# EAGLE design 3DRacers_Pilot (EAGLE 6.4)
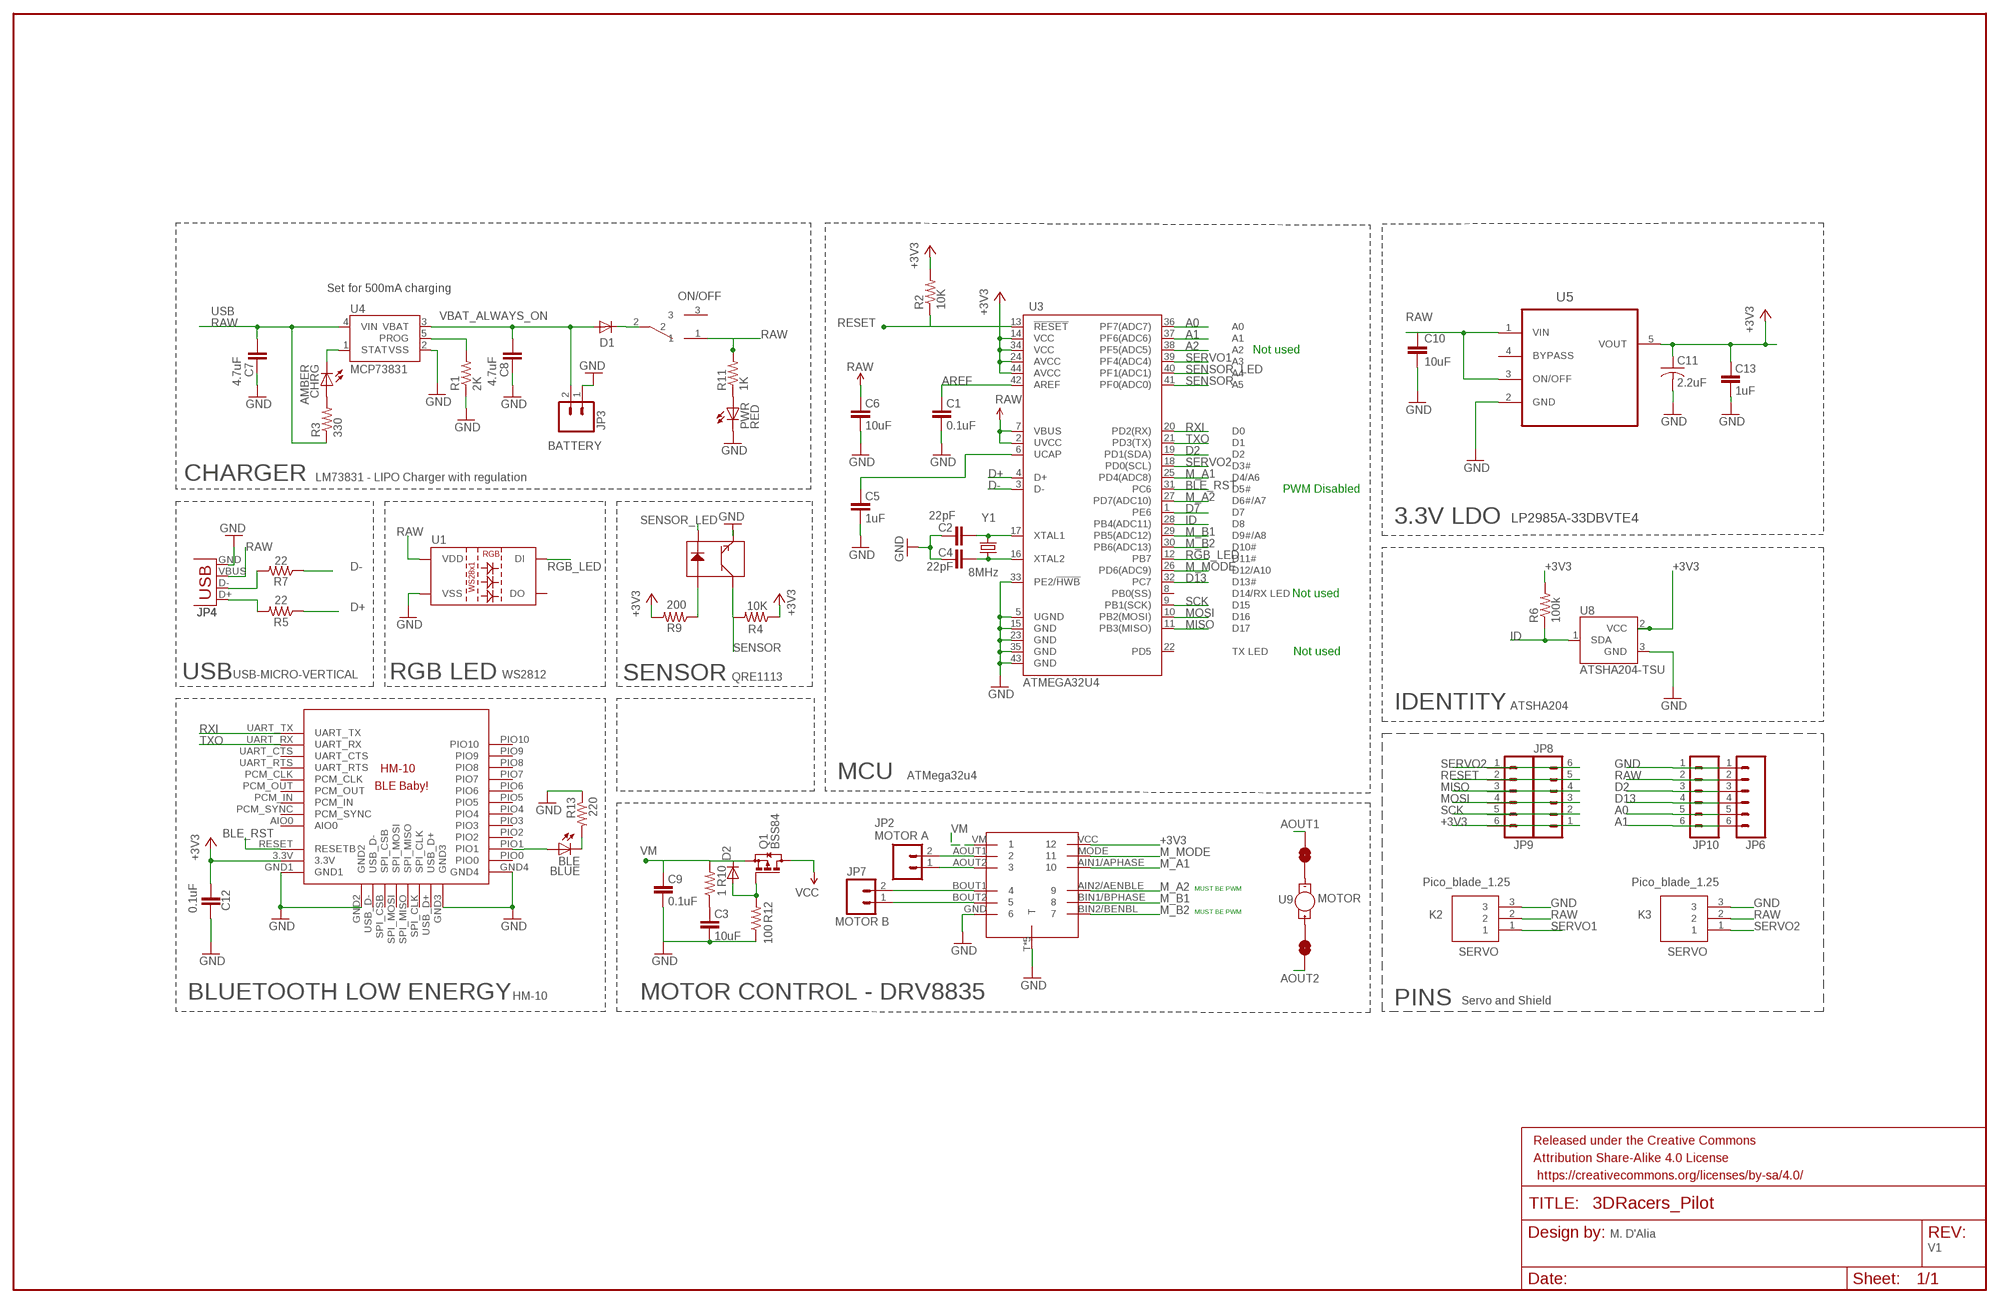
[diagram p0: schematic, sheet 1]

## Parts
BLE  BLUE  LED0603  [LED-0603]
C1  0.1uF  CAP0603-CAP  [0603-CAP]
C2  22pF  CAP0603-CAP  [0603-CAP]
C3  10uF  CAP0805  [0805]
C4  22pF  CAP0603-CAP  [0603-CAP]
C5  1uF  CAP0603-CAP  [0603-CAP]
C6  10uF  CAP0603-CAP  [0603-CAP]
C7  4.7uF  CAP0603-CAP  [0603-CAP]
C8  4.7uF  CAP0603-CAP  [0603-CAP]
C9  0.1uF  CAP0603-CAP  [0603-CAP]
C10  10uF  CAP0805  [0805]
C11  2.2uF  C-USC0603K  [C0603K]
C12  0.1uF  CAP0603-CAP  [0603-CAP]
C13  1uF  CAP0805  [0805]
CHRG  AMBER  LED0603  [LED-0603]
D1  DIODESOD  [SOD-323]
D2  DIODESOD  [SOD-323]
FRAME2  FRAME-LEDGER  [CREATIVE_COMMONS]
JP2  M021X02_NO_SILK  [1X02_NO_SILK]
JP3  M02JST-PTH-VERT  [JST-2-PTH-VERT]
JP4  USB-MICRO-VERTICAL  [USB-MICRO-VERTICAL]
JP6  M06SMD-STRAIGHT  [1X06_SMD_STRAIGHT]
JP7  M021X02_NO_SILK  [1X02_NO_SILK]
JP8  M06SMD-STRAIGHT-ALT-NOSILK  [1X06_SMD_STRAIGHT_ALT_NOSILK]
JP9  M06LOCK_LONGPADS  [1X06_LOCK_LONGPADS]
JP10  M06LOCK_LONGPADS  [1X06_LOCK_LONGPADS]
K2  PICO_BLADE_1.25  [PICO_BLADE_1.25]
K3  PICO_BLADE_1.25  [PICO_BLADE_1.25]
PWR  RED  LED0603  [LED-0603]
Q1  BSS84  [SOT23]
R1  2K  RESISTOR0603-RES  [0603-RES]
R2  10K  RESISTOR0603-RES  [0603-RES]
R3  330  RESISTOR0603-RES  [0603-RES]
R4  10K  RESISTOR0603-RES  [0603-RES]
R5  22  RESISTOR0603-RES  [0603-RES]
R6  100k  RESISTOR0603-RES  [0603-RES]
R7  22  RESISTOR0603-RES  [0603-RES]
R9  200  RESISTOR0603-RES  [0603-RES]
R10  1  RESISTOR0603-RES  [0603-RES]
R11  1K  RESISTOR0603-RES  [0603-RES]
R12  100  RESISTOR0603-RES  [0603-RES]
R13  220  RESISTOR0603-RES  [0603-RES]
SJ1  SOLDERJUMPERTRACE  [SJ_2S-TRACE]
SJ2  SOLDERJUMPERTRACE  [SJ_2S-TRACE]
U1  WS2812  LED-TRICOLOR-5050-ICWS2811  [LED-TRICOLOR-5050-IC]
U3  ATMEGA32U4  ATMEGA32U4OUTFAKES  [QFN-44-NOPAD_1:1-OUTFAKES]
U4  MCP73831  [SOT23-5]
U5  LP2985A-33DBVTE4  [SOT95P280X145-5N]
U6  QRE1113  [QRE1113]
U7  DRC8835  [DRV8835]
U8  ATSHA204-TSU  [SOT23-3]
U9  MOTOR  [MOTOR-6MM-THT]
U$2  BLE-HM-10-3DRMODIFIED-FOR-3DRACERS  [BLE-HM-10-3DR]
U$3  SWITCH  [3DRACERS_SWITCH]
Y1  8MHz  CRYSTAL5X3  [CRYSTAL-SMD-5X3]

## Nets
+3V3: C11.1 C12.1 C13.2 JP8.1 JP9.6 R2.2 R4.1 R6.2 R9.2 U3.14(VCC) U3.24(AVCC) U3.34(VCC) U3.44(AVCC) U5.5(VOUT) U7.VCC U8.2(VCC) U$2.3.3V
A0: JP6.5 JP10.5 U3.36(PF7(ADC7))
A1: JP6.6 JP10.6 U3.37(PF6(ADC6))
A2: U3.38(PF5(ADC5))
AOUT1: JP7.2 SJ1.2 U7.BOUT1
AOUT2: JP7.1 SJ2.2 U7.BOUT2
AREF: C1.2 U3.42(AREF)
BLE_CON: BLE.A U$2.PIO1
BLE_RST: U3.31(PC6) U$2.RESET(RESETB)
BOUT1: JP2.2 U7.AOUT1
D2: JP6.3 JP10.3 U3.19(PD1(SDA))
D7: U3.1(PE6)
D13: JP6.4 JP10.4 U3.32(PC7)
D+: R5.1 U3.4(D+)
D-: R7.1 U3.3(D-)
GND: C1.1 C2.2 C3.1 C4.2 C5.1 C6.1 C7.2 C8.2 C9.1 C10.2 C11.2 C12.2 C13.1 JP3.1 JP4.GND JP6.1 JP10.1 K2.3 K3.3 PWR.C R1.1 R12.1 R13.1 U1.6(VSS) U3.5(UGND) U3.15(GND) U3.23(GND) U3.33(PE2/!HWB) U3.35(GND) U3.43(GND) U4.2(VSS) U5.2(GND) U6.4(E) U7.GND U7.T U7.T@12(T) U7.T@15(T) U7.T@16(T) U7.T@17(T) U8.3(GND) U$2.GND1 U$2.GND2 U$2.GND3 U$2.GND4
ID: R6.1 U3.28(PB4(ADC11)) U8.1(SDA)
M_A1: U3.25(PD4(ADC8)) U7.AIN1/APHASE
M_A2: U3.27(PD7(ADC10)) U7.AIN2/AENBLE
M_B1: U3.29(PB5(ADC12)) U7.BIN1/BPHASE
M_B2: U3.30(PB6(ADC13)) U7.BIN2/BENBL
M_MODE: U3.26(PD6(ADC9)) U7.MODE
MISO: JP8.4 JP9.3 U3.11(PB3(MISO))
MOSI: JP8.3 JP9.4 U3.10(PB2(MOSI))
N$1: C4.1 U3.16(XTAL2) Y1.1
N$2: C2.1 U3.17(XTAL1) Y1.3
N$3: JP4.D- R7.2
N$4: C5.2 U3.6(UCAP)
N$5: R9.1 U6.1(A)
N$6: SJ1.1 U9.-
N$8: JP4.D+ R5.2
N$9: CHRG.A R3.2
N$10: JP2.1 U7.AOUT2
N$12: D2.2(A) Q1.1(G) R12.2
N$13: C3.2 R10.1
N$14: SJ2.1 U9.+
N$21: D1.1(C) U$3.2
N$35: BLE.C R13.2
N$38: PWR.A R11.1
PROG: R1.2 U4.5(PROG)
RAW: C6.2 C7.1 C10.1 JP4.VBUS JP6.2 JP10.2 K2.2 K3.2 Q1.3(D) R3.1 R11.2 U1.3(VDD) U1.5(VDD) U3.2(UVCC) U3.7(VBUS) U4.4(VIN) U5.1(VIN) U5.3(ON/OFF) U$3.1 ; supply symbol labelled VCC
RESET: JP8.5 JP9.2 R2.1 U3.13(!RESET)
RGB_LED: U1.2(DI) U3.12(PB7)
RXI: U3.20(PD2(RX)) U$2.UART_TX
SCK: JP8.2 JP9.5 U3.9(PB1(SCK))
SENSOR: R4.2 U3.41(PF0(ADC0)) U6.3(C)
SENSOR_LED: U3.40(PF1(ADC1)) U6.2(K)
SERVO1: K2.1 U3.39(PF4(ADC4))
SERVO2: JP8.6 JP9.1 K3.1 U3.18(PD0(SCL))
STAT: CHRG.C U4.1(STAT)
TXO: U3.21(PD3(TX)) U$2.UART_RX
VBAT_ALWAYS_ON: C8.1 D1.2(A) JP3.2 U4.3(VBAT)
VM: C9.2 D2.1(C) Q1.2(S) R10.2 U7.VM
Unconnected: U1.1(DO) U3.8(PB0(SS)) U3.22(PD5) U5.4(BYPASS) U$2.AIO0 U$2.PCM_CLK U$2.PCM_IN U$2.PCM_OUT U$2.PCM_SYNC U$2.PIO0 U$2.PIO2 U$2.PIO3 U$2.PIO4 U$2.PIO5 U$2.PIO6 U$2.PIO7 U$2.PIO8 U$2.PIO9 U$2.PIO10 U$2.SPI_CLK U$2.SPI_CSB U$2.SPI_MISO U$2.SPI_MOSI U$2.UART_CTS U$2.UART_RTS U$2.USB_D+ U$2.USB_D- U$3.3

## Notes on the sheet
- Set for 500mA charging | ON/OFF
- USB
- Not used
- BATTERY
- CHARGER | LM73831 - LIPO Charger with regulation
- PWM Disabled
- 3.3V LDO
- Not used
- Not used
- USB | RGB LED | SENSOR | QRE1113
- IDENTITY | ATSHA204
- MCU | ATMega32u4
- MOTOR A
- VM
- MUST BE PWM
- MUST BE PWM
- K2 | K3
- MOTOR B
- BLUETOOTH LOW ENERGY | HM-10 | MOTOR CONTROL - DRV8835
- PINS | Servo and Shield
- M. D'Alia
- V1

## Library data of the parts
BLE CHRG PWR = SparkFun:LED: LEDs Standard schematic elements and footprints for 5mm, 3mm, 1206, and 0603 sized LEDs. 5mm - Spark Fun Electronics SKU : COM-00529 (and others); OC_FARNELL: unknown
C1 C2 C4-C9 C12 = SparkFun:CAP: Capacitor Standard 0603 ceramic capacitor, and 0.1" leaded capacitor.; OC_FARNELL: unknown
C3 C13 = SparkFun-Capacitors:CAP: Capacitor Standard 0603 ceramic capacitor, and 0.1" leaded capacitor.; OC_FARNELL: unknown
C10 = SparkFun-Capacitors:CAP: Capacitor Standard 0603 ceramic capacitor, and 0.1" leaded capacitor.; MF: AVX; MPN: 06036D105KAT2A; OC_FARNELL: 1327676
C11 = rcl:C-US: CAPACITOR, American symbol; MF: AVX; MPN: 0603YD225MAT2A; OC_FARNELL: 2332678
D1 D2 = SparkFun-DiscreteSemi:DIODE: Diode These are standard reverse protection diodes and small signal diodes. SMA package can handle up to about 1A. SOD-323 can handle about 200mA. What the SOD-323 package when ordering, there are some mfgs out there that are 5-pin packages.; PROD_ID: DIO-09646
FRAME2 = SparkFun-Aesthetics:FRAME-LEDGER: Schematic Frame Standard 11x14 US Ledger frame
JP2 JP3 JP7 = SparkFun-Connectors:M02: Standard 2-pin 0.1" header. Use with - straight break away headers ( PRT-00116) - right angle break away headers (PRT-00553) - swiss pins (PRT-00743) - machine pins (PRT-00117) - female headers (PRT-00115) Molex polarized connector foot print use with: PRT-08233 with associated crimp pins and housings. 2.54_SCREWTERM for use with PRT-10571. 3.5mm Screw Terminal footprints for PRT-08084 5mm Screw Terminal footprints for use with PRT-08433; OC_FARNELL: unknown
JP4 = SparkFun-Connectors:USB-MICRO-VERTICAL; OC_FARNELL: unknown
JP6 JP8-JP10 = SparkFun-Connectors:M06: Header 6 Standard 6-pin 0.1" header. Use with straight break away headers (SKU : PRT-00116), right angle break away headers (PRT-00553), swiss pins (PRT-00743), machine pins (PRT-00117), and female headers (PRT-00115). Molex polarized connector foot print use with SKU : PRT-08094 with associated crimp pins and housings. NOTES ON THE VARIANTS LOCK and LOCK_LONGPADS... This footprint was designed to help hold the alignment of a through-hole component (i.e. 6-pin header) while soldering it into place. You may notice that each hole has been shifted either up or down by 0.005 of an inch from it's more standard position (which is a perfectly straight line). This slight alteration caused the pins (the squares in the middle) to touch the edges of the holes. Because they are alternating, it causes a "brace" to hold the component in place. 0.005 has proven to be the perfect amount of "off-center" position when using our standard breakaway headers. Although looks a little odd when you look at the bare footprint, once you have a header in there, the alteration is very hard to notice. Also,if you push a header all the way into place, it is covered up entirely on the bottom side. This idea of altering the position of holes to aid alignment will be further integrated into the Sparkfun Library for other footprints. It can help hold any component with 3 or more connection pins.
K2 K3 = SparkFun-Connectors:PICO_BLADE_1.25; OC_FARNELL: unknown
Q1 = transistor-small-signal:BSS84: P-CHANNEL MOS FET; OC_FARNELL: unknown
R1-R5 R7 R9-R12 = SparkFun:RESISTOR: Resistor Basic schematic elements and footprints for 0603, 1206, and PTH resistors.; OC_FARNELL: unknown
R6 = SparkFun-Passives:RESISTOR: Resistor Basic schematic elements and footprints for 0603, 1206, and PTH resistors.; OC_FARNELL: unknown
R13 = SparkFun:RESISTOR: Resistor Basic schematic elements and footprints for 0603, 1206, and PTH resistors.; MF: STEINBACH AND VOLLMANN; MPN: 0.87.0022.0; OC_FARNELL: 1516458
SJ1 SJ2 = SparkFun-Passives:SOLDERJUMPER: Solder Jumper Standard SMD solder jumper. Used to automate production. Two varients : Normally Open and Normally Closed are the same, but have different paste layers. NC will have a large amount of paste and should jumper during reflow.
U1 = SparkFun-LED:LED-TRICOLOR-5050-IC: WS2811 RGB LED w/driver 5x5mm SMD LED with built-in controller IC. DIO-11598; OC_FARNELL: unknown; PROD_ID: DIO-11598; VALUE: WS2811
U3 = Testing:ATMEGA32U4: Atmel 44-pin 8-bit Microcontroller with 32KBytes of ISP Flash and USB Controller; OC_FARNELL: unknown
U4 = SparkFun:MCP73831: Microchip's MCP73831 Miniature single cell, fully integrated Li-Ion, Li-polymer charge management controller http://ww1.microchip.com/downloads/en/DeviceDoc/21984a.pdf; OC_FARNELL: unknown
U5 = Texas Instruments_By_element14_Batch_1:LP2985A-33DBVTE4: 150-mA LOW-NOISE LOW-DROPOUT REGULATOR WITH SHUTDOWN; MF: TEXAS INSTRUMENTS; MPN: LP2985A-33DBVTE4; OC_FARNELL: 1053660; OC_NEWARK: 79K3928; PACKAGE: SOT-23-5; SUPPLIER: Texas Instruments
U6 = SparkFun-Sensors:QRE1113: Reflective object sensor; OC_FARNELL: unknown; PROD_ID: IC-09357
U7 = DRV8835:DRC8835; OC_FARNELL: unknown
U8 = SparkFun-DigitalIC:ATSHA204: Atmel ATSHA204 The Atmel ATSHA204 is an optimized authentication chip that includes a 4.5Kb EEPROM. This array can be used for storage of keys, miscellaneous read/write, read-only, password or secret data, and consumption tracking. Access to the various sections of memory can be restricted in a variety of ways and then the configuration locked to prevent changes.; OC_FARNELL: unknown
U9 = 3dracers:MOTOR: Vibration Motor- ROB-08449 Physical dimension and wire connections for this powerful vibration motor. Motor has a self adhesive backing.
U$2 = ble-hm10-3dr:BLE-HM-10-3DR; OC_FARNELL: unknown
U$3 = 3dracers:SWITCH; OC_FARNELL: unknown
Y1 = SparkFun:CRYSTAL: Crystals Various standard crystals. Proven footprints. Spark Fun Electronics SKU : COM-00534; OC_FARNELL: unknown

## Net classes
1 pwr: width 0.5 mm, clearance 0.2 mm

## Board
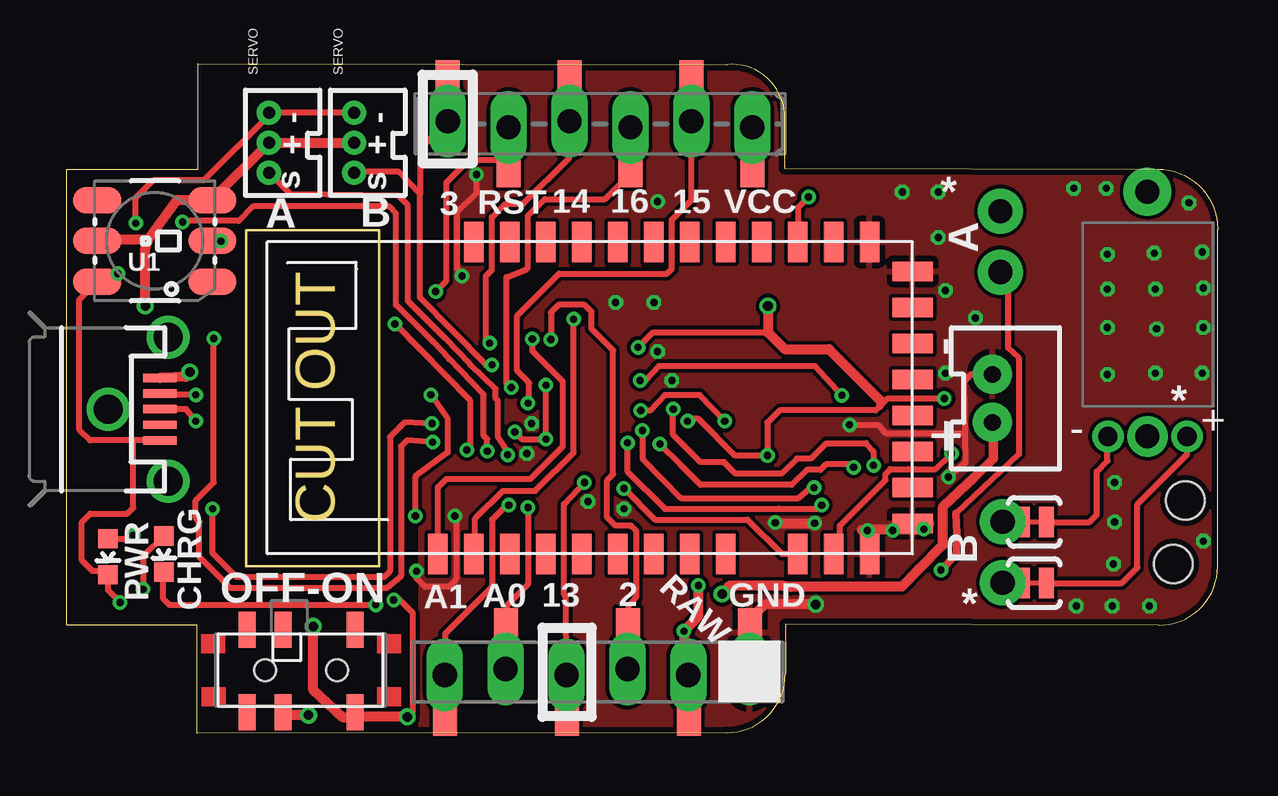
[diagram p1: board, top side]
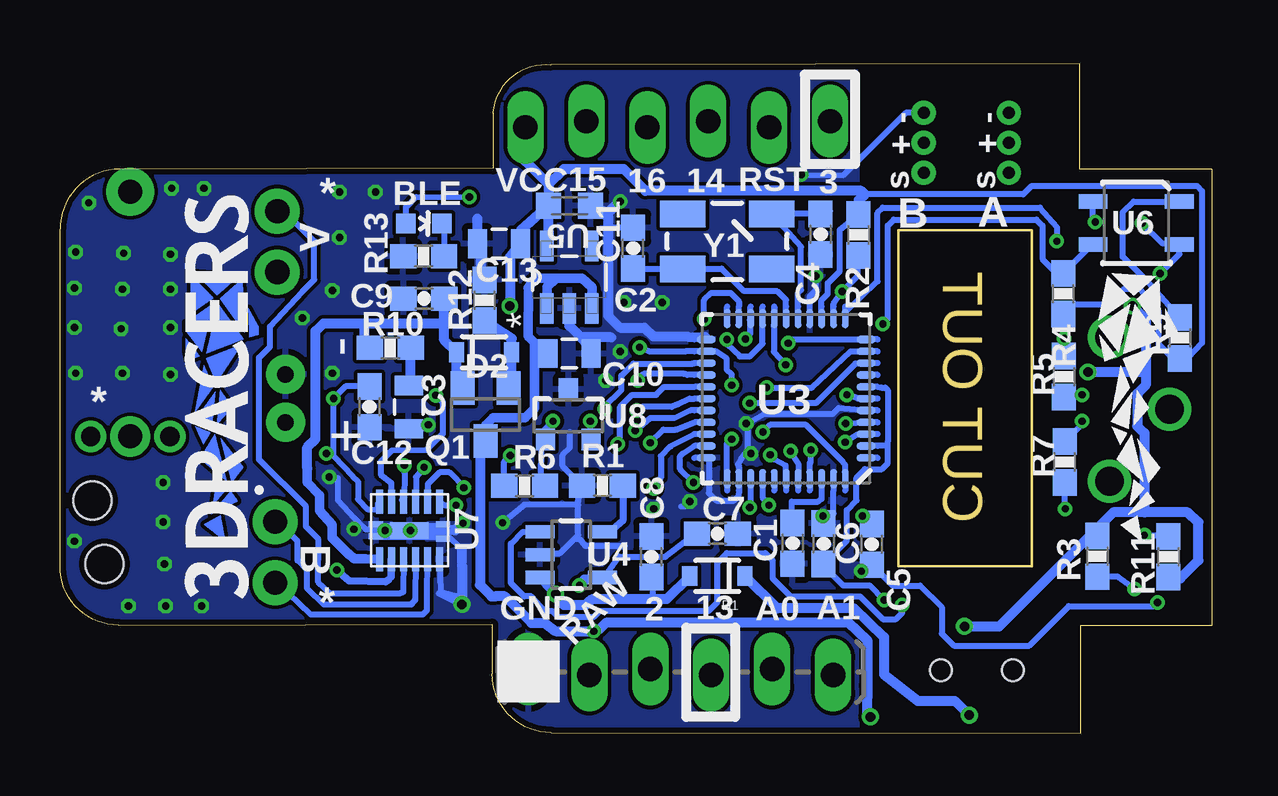
[diagram p2: board, bottom side, seen from below]

Size 48 x 27.9 mm. Coordinates in mm from the lower left corner, seen from the top.
Outline: 0,23.5 5.5,23.5 5.5,27.9 27.54,27.86 arc-90 29.94,25.86 29.94,23.53 45.5,23.5 arc-90 48,21 48,6.95 arc-90 45.55,4.5 29.98,4.53 29.98,2.47 arc-90 27.53,0.02 5.45,0 5.45,4.5 0,4.5 0,23.5
Outline: 7.5,20.95 13.05,20.95 13.05,6.95 7.5,6.95 7.5,20.95
Copper layers (1*16): Top 0.035mm / dielectric 1.5mm / Bottom 0.035mm
Design rules "ITEADstudio_DRC *": minimum track width 6mil, minimum drill 11mil, track to track 6mil, track to pad 6mil, pad to pad 6mil, via to via 6mil, smd to smd 0mil, copper to edge 10mil, drill to drill 10mil, minimum pad ring 10mil, minimum via ring 6mil, stop-mask expansion 2mil, vias tented up to drill 100mil, thermal gap 10mil
Holes 1.6 mm at 46.65,9.7 46.15,7.05
tKeepout: area 7.6,7 to 13.1,20.9
bKeepout: area 7.6,7.1 to 13.1,20.8

### Footprints (pad centres in the part's own frame; a part is rotated, then mirrored left to right if it is on the bottom)
LED-0603 = smd 0.8 x 0.8: A 0,-0.75; C 0,0.75
0603-CAP = smd 1.1 x 1: 1 -0.85,0; 2 0.85,0
0805 = smd 0.8 x 1.2: 1 -0.9,0; 2 0.9,0
C0603K = smd 1.05 x 1.08: 1 -0.875,0; 2 0.875,0
SOD-323 = smd 0.63 x 0.83: 1 -1.15,0; 2 1.15,0
1X02_NO_SILK = drill 1.016 pad 1.88: 1 0,0; 2 2.54,0
JST-2-PTH-VERT = drill 0.7 pad 1.626: 1 -1,-0.55; 2 1,-0.55
USB-MICRO-VERTICAL = smd 0.35 x 1.4: D+ 0,2.65; D- -0.65,2.65; GND 1.3,2.65; ID 0.65,2.65; VBUS -1.3,2.65 | drill 1.2: P$1 3,3; P$2 -3,3; P$3 0,0.5
1X06_SMD_STRAIGHT = smd 1 x 2: 1 0,1.65; 2 -2.54,-1.65; 3 -5.08,1.65; 4 -7.62,-1.65; 5 -10.16,1.65; 6 -12.7,-1.65
1X06_SMD_STRAIGHT_ALT_NOSILK = smd 1 x 2: 1 0,-1.65; 2 -2.54,1.65; 3 -5.08,-1.65; 4 -7.62,1.65; 5 -10.16,-1.65; 6 -12.7,1.65
1X06_LOCK_LONGPADS = drill 1.016 long: 1 0,0; 2 2.54,-0.254; 3 5.08,0; 4 7.62,-0.254; 5 10.16,0; 6 12.7,-0.254
PICO_BLADE_1.25 = drill 0.5 pad 1: 1 -2,0; 2 -0.75,0; 3 0.5,0
SOT23 = smd 1 x 1.4: 1 -0.95,-1.1; 2 0.95,-1.1; 3 0,1.1
0603-RES = smd 1.1 x 1: 1 -0.85,0; 2 0.85,0
SJ_2S-TRACE = smd 0.635 x 1.27: 1 -0.508,0; 2 0.508,0
LED-TRICOLOR-5050-IC = smd 2 x 1.1: 1 -2.4,1.7; 2 -2.4,0; 3 -2.4,-1.7; 4 2.4,-1.7; 5 2.4,0; 6 2.4,1.7
QFN-44-NOPAD_1:1-OUTFAKES = smd 0.8 x 0.3: 1 -3.337,2.465; 2 -3.337,1.972; 3 -3.337,1.479; 4 -3.337,0.986; 5 -3.337,0.493; 6 -3.337,0; 7 -3.337,-0.493; 8 -3.337,-0.986; 9 -3.337,-1.479; 10 -3.337,-1.972; 11 -3.337,-2.465; 23 3.337,-2.465; 24 3.337,-1.972; 25 3.337,-1.479; 26 3.337,-0.986; 27 3.337,-0.493; 28 3.337,0; 29 3.337,0.493; 30 3.337,0.986; 31 3.337,1.479; 32 3.337,1.972; 33 3.337,2.465 | smd 0.3 x 0.8: 12 -2.465,-3.337; 13 -1.972,-3.337; 14 -1.479,-3.337; 15 -0.986,-3.337; 16 -0.493,-3.337; 17 0,-3.337; 18 0.493,-3.337; 19 0.986,-3.337; 20 1.479,-3.337; 21 1.972,-3.337; 22 2.465,-3.337; 34 2.465,3.337; 35 1.972,3.337; 36 1.479,3.337; 37 0.986,3.337; 38 0.493,3.337; 39 0,3.337; 40 -0.493,3.337; 41 -0.986,3.337; 42 -1.479,3.337; 43 -1.972,3.337; 44 -2.465,3.337
SOT23-5 = smd 0.55 x 1.2: 1 -0.95,-1.3; 2 0,-1.3; 3 0.95,-1.3; 4 0.95,1.3; 5 -0.95,1.3
SOT95P280X145-5N = smd 1.27 x 0.559: 1 -1.295,0.94; 2 -1.295,0; 3 -1.295,-0.94; 4 1.295,-0.94; 5 1.295,0.94
QRE1113 = smd 1.2 x 0.6: 1 -1.8,-0.9; 2 1.8,-0.9; 3 1.8,0.9; 4 -1.8,0.9
DRV8835 = smd 1 x 0.3: AIN1/APHASE 1.2,0.25; AIN2/AENBLE 1.2,-0.25; AOUT1 -1.2,0.75; AOUT2 -1.2,0.25; BIN1/BPHASE 1.2,-0.75; BIN2/BENBL 1.2,-1.25; BOUT1 -1.2,-0.25; BOUT2 -1.2,-0.75; GND -1.2,-1.25; MODE 1.2,0.75; VCC 1.2,1.25; VM -1.2,1.25 | smd 0.7 x 1.6: T 0,0 | smd 0.25 x 0.6: T@12 -0.25,1.4; T@15 0.25,1.4; T@16 0.25,-1.4; T@17 -0.35,-1.4
SOT23-3 = smd 0.8 x 0.9: 1 -0.95,-1; 2 0.95,-1; 3 0,1.1
MOTOR-6MM-THT = drill 0.8 pad 1.3: + -1.72,5.135; - 1.58,5.135 | drill 1 pad 1.676: GND -0.07,5.135 | drill 1 pad 2: GND1 -0.07,-5.065
BLE-HM-10-3DR = smd 1.676 x 0.813: 3.3V 0,3.29; AIO0 0,7.79; GND1 0,1.79; GND4 13,1.79; PCM_CLK 0,13.79; PCM_IN 0,10.79; PCM_OUT 0,12.29; PCM_SYNC 0,9.29; PIO0 13,3.29; PIO1 13,4.79; PIO2 13,6.29; PIO3 13,7.79; PIO4 13,9.29; PIO5 13,10.79; PIO6 13,12.29; PIO7 13,13.79; PIO8 13,15.29; PIO9 13,16.79; PIO10 13,18.29; RESET 0,4.79; UART_CTS 0,16.79; UART_RTS 0,15.29; UART_RX 0,18.29; UART_TX 0,19.79 | smd 0.813 x 1.676: GND2 1.27,0; GND3 11.77,0; SPI_CLK 8.77,0; SPI_CSB 4.27,0; SPI_MISO 7.27,0; SPI_MOSI 5.77,0; USB_D+ 10.27,0; USB_D- 2.77,0
3DRACERS_SWITCH = smd 0.7 x 1.5: 1 -0.75,1.75; 1@2 -0.75,-1.679; 2 2.25,1.75; 2@2 2.25,-1.679; 3 3.75,1.75; 3@2 3.75,-1.679 | hole 0.9: 0,0; 3,0
CRYSTAL-SMD-5X3 = smd 1.9 x 1.1: 1 -1.85,-1.15; 2 1.85,-1.15; 3 1.85,1.15; 4 -1.85,1.15

### Placement (x,y rotation side)
BLE  32.83,21.24 270 bottom
C1  17.46,7.91 90 bottom
C2  24.11,20.21 90 bottom
C3  33.46,13.59 90 bottom
C4  16.3,20.79 270 bottom
C5  14.16,7.87 90 bottom
C6  16.17,7.9 270 bottom
C7  20.6,8.31 0 bottom
C8  23.35,7.35 90 bottom
C9  32.83,18.11 0 bottom
C10  26.77,15.82 0 bottom
C11  26.76,21.98 0 bottom
C12  35.1,13.6 270 bottom
C13  29.7,20.4 0 bottom
CHRG  4.07,7.47 180 top
D1  20.6,6.55 180 bottom
D2  30.32,15.87 0 bottom
FRAME2  -2.45,-10.8 0 top  (outside the outline)
JP2  38.94,21.75 270 top
JP3  39.15,13.95 270 top
JP4  1.25,13.5 270 top
JP6  28.5,2.55 0 top
JP7  39.03,6.27 90 top
JP8  28.6,25.4 0 top
JP9  15.9,25.5 0 top
JP10  28.47,2.68 0 bottom
K2  8.45,25.35 90 top
K3  12,25.35 90 top
PWR  1.74,7.36 180 top
Q1  30.26,13.28 180 bottom
R1  25.39,10.32 0 bottom
R2  14.71,20.76 90 bottom
R3  4.76,7.37 270 bottom
R4  6.18,18.31 90 bottom
R5  6.12,11.3 90 bottom
R6  28.63,10.31 180 bottom
R7  6.15,14.86 270 bottom
R9  1.32,16.47 270 bottom
R10  34.23,16.05 180 bottom
R11  1.79,7.35 270 bottom
R12  30.31,18.04 270 bottom
R13  32.84,19.87 0 bottom
SJ1  40.35,8.8 180 top
SJ2  40.35,6.25 180 top
U1  3.69,20.51 180 top
U3  17.73,13.94 180 bottom
U4  26.69,7.44 270 bottom
U5  26.77,19 90 bottom
U6  3.14,21.26 180 bottom
U7  33.43,8.45 90 bottom
U8  26.81,13.23 0 bottom
U9  45,17.5 180 top
U$2  35.28,7.47 90 top
U$3  11.29,2.63 180 top
Y1  20.19,20.49 180 bottom

### Tracks (layer width: path | path; a pad name or v marks a point on that pad's centre or on a via)
+3V3  (via drill 0.3, 0.4)
  Top 0.254: U$2.3.3V 32.25,7.73 32.25,8.65 34.15,10.55 34.15,10.8 34.35,11 35.1,11 35.39,11.01 36.24,11.01 36.88,11.6 v36.9,11.65 | v36.6,13.95 34.25,13.95 33.92,13.62 33.75,13.45 29.74,13.45 29.23,12.94 v29.23,11.57 27.88,11.57 26.35,13.1 26.05,13.1 v25.9,13 | 23.89,16.04 v23.84,16.08 24.46,16.7 29.25,16.7 | v20,14.5 v20,12.25 19,12.25 v18.7,12.55 | JP8.1 28.45,24
  Top 0.305: 33.92,13.88 33.92,13.62
  Top 0.406: v29.25,17.8 29.25,16.7 29.95,16 31.8,16 33.92,13.88 | JP8.1 JP9.6
  Bottom 0.254: 21.56,15.91 21.92,15.91 23.46,15.92 23.82,16.08 v23.84,16.08 | U7.VCC 34.73,9.6 34.73,9.34 35.15,9.32 35.58,9.75 35.58,10.49 35.79,10.69 36.6,11.55 36.6,11.75 | U3.44 15.27,11.16 15.37,11.31 16.9,12.85 18.4,12.85 v18.7,12.55 | 16.25,17.77 16.25,18.05 16,18.3 16,18.75 15.5,19.25 15.5,20.97 R2.2 | v20,14.5 20,14.95 20.2,15.15 20.2,15.6 20.66,15.91 U3.24 | U3.34 20.2,12.05 v20,12.25 | R6.2 29.48,11.32 v29.23,11.57 | 36.6,11.75 v36.6,13.95 36.1,14.45 C12.1 | v36.9,11.65 37,11.75 36.6,11.75 | 27.71,21.89 27.91,22.1 | 14.45,22.45 7.85,22.45 7.5,22.8 0.6,22.8 0.4,22.6 0.4,16.25 0.98,15.62 R9.2 1.6,15.6 2.2,16.2 2.2,17.6 3,18.5 3.65,18.5 4.3,17.85 5.79,17.85 R4.1 | v25.9,13 25.9,12.27 U8.2
  Bottom 0.406: C11.1 27.68,21.92 27.71,21.89 | 27.64,22.86 C11.1 | 27.64,22.86 27,23.5 24.5,23.5 23.6,22.6 14.6,22.6 14.45,22.45 14.7,22.22 R2.2 | U5.5 27.64,20.37 C11.1 | C11.1 28.77,20.98 28.77,20.43 C13.2 29.25,19.85 v29.25,17.8 | 27.64,22.86 28.6,23.83 JP9.6
A0  (via drill 0.3)
  Top 0.254: JP6.5 18.44,3.5 | 18.44,3.5 18.44,2.7 JP10.5 | v19.25,9.4 19.25,6.2 18.4,5.35 18.4,3.81 18.44,3.5
  Bottom 0.254: 19.21,10.11 19.21,9.44 v19.25,9.4
A1  (via drill 0.3)
  Top 0.254: JP6.6 15.75,2.15 JP10.6 15.8,4.15 17.75,6.1 17.75,8.9 18.5,9.65 v18.45,9.5
  Bottom 0.254: 18.72,10.11 18.72,9.82 v18.45,9.5
AOUT1
  Top 0.254: JP7.2 SJ1.2
  Bottom 0.254: U7.BOUT1 33.19,5.56 33.36,5.36 37,5.36 37.7,6.04 37.7,6.8 38.1,7.2 38.1,8 38.91,8.81 JP7.2
AOUT2
  Top 0.254: JP7.1 39.05,6.25 SJ2.2
  Bottom 0.254: U7.BOUT2 32.7,5.71 32.7,5.12 32.87,4.95 37.55,4.95 38.92,6.27 JP7.1
AREF
  Bottom 0.254: 16.25,10.11 16.25,9.75 16.4,9.65 17.5,9.65 C1.2
BLE_CON  (via drill 0.3)
  Top 0.254: v30.94,22.34 30.5,21.9 U$2.PIO1
  Bottom 0.254: BLE.A 33.58,21.92 33.15,22.35 v30.94,22.34
BLE_RST  (via drill 0.3)
  Top 0.254: 30.47,7.45 U$2.RESET 29.83,7.47 28.4,8.9 24.55,8.9 v23.25,10.2
  Bottom 0.254: 21.56,12.46 22.55,11.95 22.95,11.55 22.95,10.65 23.25,10.35 v23.25,10.2
BOUT1  (via drill 0.3 pad 0.3)
  Top 0.254: 37.09,9.17 39.71,11.64 39.7,15.65 39.26,16.06 39.26,18.74 JP2.2
  Top 0.305: 37.09,9.17 37.12,8.3 37.11,7.45 v36.46,6.8 36.35,6.69
  Bottom 0.305: v36.46,6.8 35.94,6.35 34.42,6.32 34.31,6.4 34.19,6.52 U7.AOUT1
D2  (via drill 0.3)
  Top 0.254: v20.2,16.4 20.2,17.53 20.52,17.85 21.6,17.85 21.9,17.55 21.9,16.85 22,16.75 22.45,16.3 22.8,15.95 22.8,10.8 22.55,10.55 22.55,9 22.9,8.65 23.55,8.65 23.75,8.45 23.75,5.65 23.42,5.27 JP6.3 23.42,2.7 JP10.3
  Bottom 0.254: v20.2,16.4 20.2,16.2 19.66,15.7 19.25,15.7 18.72,16.23 U3.19
D13  (via drill 0.3)
  Top 0.254: JP6.4 20.88,2.4 JP10.4 20.83,5.68 20.75,5.8 20.75,9.55 v21.6,10.45
  Bottom 0.254: v21.6,10.45 22.15,11 22.15,11.55 22.05,11.65 21.56,11.97
D+  (via drill 0.3)
  Top 0.254: v15.25,12.9 14.1,12.95 13.5,12.35 13.5,6.75 13.25,6.5 7.1,6.5 6.1,7.5 v6.1,9.35
  Bottom 0.254: 13.92,12.95 v15.25,12.9 | v6.1,9.35 6.12,9.37 R5.1
D-  (via drill 0.3)
  Top 0.254: v15.28,12.12 14.2,12.2 13.95,11.95 13.95,6.55 13.35,6.05 6.85,6.05 5.55,7.35 5.55,8.8 5.4,8.95 5.4,9.7 6.15,10.45 v6.15,16.45
  Bottom 0.254: 13.92,12.46 14.75,12.45 v15.28,12.12 | v6.15,16.45 R7.1
GND  (via drill 0.3, 0.3 pad 0.25, 0.4)
  Top 0.152: v34.45,8.45 34.54,8.51 34.54,8.47
  Top 0.25: 37.43,14.65 37.49,11.28 v36.78,10.68
  Top 0.254: 24.65,22.25 v24.65,22.15 | v32.65,12.85 33.85,12.85 34.15,12.5 37.47,12.5 37.49,11.28 | JP3.1 37.72,14.95 37.43,14.65 | v16.5,19.05 16.5,19.15 16.3,19.35 16.3,21.7 17.1,22.5 v17.1,23.27 | K3.3 K2.3 8.45,25.75 5.75,23.05 3.65,23.05 2.9,22.3 v2.9,21.25 | v2.25,5.45 1.74,5.96 PWR.C 1.6,6.75 1.1,6.75 0.65,7.2 0.65,8.8 1,9.15 2.55,9.15 2.8,9.4 2.8,12.15 2.85,12.2 | JP4.GND 2.85,12.2 | 2.85,12.2 1,12.2 0.55,12.65 0.55,18.07 U1.6 1.78,18.8 v2.15,19.15 | v16.2,9.05 16.25,9 16.25,6.4 15.95,6.1 14.95,6.1 14.6,6.45 v14.6,6.75
  Top 0.406: 33.4,8.47 34.54,8.47 35.4,8.47 35.7,8.49 35.7,8.5 v35.75,8.5 | 33.15,8.47 33.4,8.47 | 33.4,8.47 v33.4,8.45 | JP10.1 28.3,4.15 | 28.3,4.15 JP6.1 | v31.24,5.37 29.12,5.37 28.3,4.6 28.3,4.15 | v29.55,8.77 29.57,8.75 v31.2,8.75
  Bottom 0.152: 33.53,8.26 33.53,8.25 | 33.53,8.55 33.53,8.51 | 33.53,8.51 33.53,8.26 | 33.53,8.26 U7.T 33.53,8.51 | 31.5,5.47 31.45,5.66 v31.24,5.37 | 32.21,5.82 32.13,5.89 | 33.53,8.51 v33.4,8.45 | 35.56,8.51 35.56,8.77 35.54,8.78 | 28.19,7.5 U4.2 | 31.24,6.99 31.25,7.15
  Bottom 0.25: 19.7,10.11 19.72,9.87 | 36.42,10.63 36.42,9.72 35.72,8.96
  Bottom 0.254: C3.1 33.76,12.79 33.31,12.9 33.41,12.55 33.3,12.9 v32.65,12.85 | 34.85,8.6 34.88,8.6 34.9,8.58 | 35.72,8.96 35.54,8.78 35.25,8.49 34.9,8.49 | 19.72,9.87 19.9,9.69 20.64,9.69 20.95,10 20.95,11.36 U3.33 | U7.GND 32.13,5.89 31.45,5.72 | 32.21,5.82 31.5,5.47 | 35.56,8.51 v35.75,8.5 | 31.9,8.3 31.25,7.65 | 16.74,17.77 16.74,18.21 16.5,18.45 v16.5,19.05 16.5,19.74 C4.2 16.55,19.64 | 28.19,7.5 27.15,7.5 26.57,8.07 | 26.57,8.07 26.4,8.25 26.4,9.51 | 26.4,9.51 26.4,9.66 R1.1 27.05,11.13 27.05,11.6 26.75,11.9 26.75,12.55 | 19.7,10.11 | 22.1,9.45 21.95,9.45 | 24.45,7.8 26.1,7.8 26.32,8.07 26.57,8.07 | 26.4,9.51 26.42,9.53 28.64,9.53 v29.55,8.77 | C10.2 26.04,15.34 | 36.42,10.63 36.73,10.63 v36.78,10.68 | U3.5 14.6,13.45 15.55,13.55 15.8,13.3 18.65,13.3 19.35,12.9 19.35,11.8 19.6,11.45 19.75,11.2 19.7,11.1 U3.35 | 15.76,10.11 15.76,9.16 C6.1 16.17,8.58 16.2,8.61 v16.2,9.05 | 21.1,16.5 21.2,16.4 21.56,16.4 | K3.3 12.75,25.85 15.35,23.25 v17.1,23.27 | v2.25,5.45 2.4,5.3 5.95,5.3 7.6,3.65 10.75,3.65 11.25,4.15 11.25,5.25 12.15,6.15 13.29,6.15 C5.1 14.33,7.02 v14.6,6.75 | C2.2 25.14,21.06 25.15,21.05 | v2.15,19.15 1.34,19.96 U6.4 2.03,20.4 v2.9,21.25
  Bottom 0.406: 34.83,8.62 34.85,8.6 34.85,8.3 34.83,8.28 | 34.9,8.49 34.9,8.58 | 32.1,8.25 33.53,8.25 34.9,8.25 | 31.95,8.55 33.53,8.55 34.95,8.55 | 31.24,6.99 v31.24,5.37 | v24.65,22.15 25.17,21.68 C11.2 25.15,21.7 25.15,21.05 25.15,17.4 24.65,16.9 23.65,16.9 23.27,16.52 21.85,16.52 21.1,16.5 | 25.02,16.49 26.21,16.49 26.25,16.45 | 26.25,16.45 26.77,16.97 U5.2 | 26.25,16.45 26.04,16.25 C10.2 | 31.25,7.15 31.25,7.65 | v31.2,8.75 31.55,8.45 v33.4,8.45 | R12.1 30.26,18.99 30.45,19.4 30.45,20.8 C13.1 30.6,21.45
  other vias: 21.75,9.65 23.25,9.35 19.4,12.9 24.65,15.9 22.9,17.95 36.35,22.55 36.65,18.45 36.65,15 24.5,17.95 42,22.7 43.35,22.7 46.8,22.1 42.1,5.3 43.6,5.3 45.15,5.3 47.35,20.05 47.4,18.55 47.4,16.9 47.4,8 43.65,7.05 43.7,8.8 37.9,17.3 36.35,20.65 34.85,22.55 45.35,20 45.4,18.5 45.45,16.85 43.4,19.95 43.4,16.9 43.7,10.45 45.4,15 47.35,15 43.4,14.95 43.4,18.5 25.25,14.7 19.2,11.65
  pour Top: 14.75,0 14.75,23.7 14.8,27.95 29.85,27.73 29.9,23.63 32.28,23.66 39.95,23.45 45.4,23.45 arc-90 48.02,20.85 48.1,10.5 48.05,7.18 arc-89 45.22,4.4 39.97,4.39 30.05,4.55 30.05,0
  pour Bottom: 14.75,0 14.75,23.7 14.8,27.95 30.09,27.83 30.04,23.58 45.54,23.43 arc-90 48.06,20.87 47.99,7.12 arc-90 45.3,4.45 30.03,4.49 29.83,0.09
  pour Bottom: 31.3,5.25 36.3,5.25 36.2,10.35 31.15,10.35 31.15,6.4
ID  (via drill 0.3)
  Top 0.254: 27.2,13.25 v27.45,13 26.4,14.1 24.95,14.1 24.35,13.45 v23.95,13.45
  Bottom 0.254: 21.56,13.94 21.76,13.94 22.25,13.7 22.5,13.6 23.75,13.6 v23.95,13.45 | R6.1 27.96,10.49 27.95,12.05 U8.1 27.91,12.54 v27.45,13
M_A1  (via drill 0.3, 0.3 pad 0.3)
  Top 0.25: 31.04,11.44 30.45,11.44 29.82,10.82 27.89,10.82 27.42,11.3 26.45,11.3
  Top 0.254: 31.04,11.44 31.68,12.08 33.33,12.08 33.64,11.75 v33.65,11.16 | 26.45,11.3 25.3,12.44 v25.3,13.5
  Bottom 0.254: 21.56,15.42 21.64,15.4 24.1,15.4 24.6,14.9 24.6,14.3 25.3,13.6 v25.3,13.5 | v33.65,11.16 33.64,10.86 33.65,9.73 33.74,9.71 U7.AIN1/APHASE
M_A2  (via drill 0.3)
  Top 0.25: 31.45,10.97 31.44,10.97 30.87,10.97 30.24,10.35 26.44,10.35
  Top 0.254: 31.44,10.97 31.67,11.2 32.7,11.2 v32.82,11.08 | v24.75,12.05 25.6,11.2 25.6,11.19 26.44,10.35
  Bottom 0.254: 33.19,9.68 U7.AIN2/AENBLE 33.16,10.67 v32.82,11.08 | 21.56,14.43 22.82,14.43 23.15,14.1 24.15,14.1 24.65,13.6 24.65,12.15 v24.75,12.05
M_B1  (via drill 0.3, 0.3 pad 0.3)
  Top 0.254: v24.02,12.61 24.03,11.43 25.63,9.8 30.52,9.8 31.11,10.29 v31.17,10.23
  Bottom 0.254: U7.BIN1/BPHASE 32.67,10.38 32.18,10.87 31.77,10.87 31.11,10.21 v31.17,10.23 | 21.56,13.45 21.72,13.45 22.39,13.13 23.4,13.13 v24.02,12.61
M_B2  (via drill 0.3, 0.3 pad 0.3)
  Top 0.254: v23.4,12.1 23.4,10.9 24.95,9.35 29.69,9.36 31.33,9.36 v31.49,9.5
  Bottom 0.254: U7.BIN2/BENBL 31.94,9.49 v31.49,9.5 | v23.4,12.1 22.85,12.65 22.35,12.65 21.56,12.95
M_MODE  (via drill 0.3)
  Top 0.254: v23.92,14.7 24.15,14.7 24.7,15.3 31.21,15.31 v32.33,14.08
  Bottom 0.254: U3.26 21.86,14.93 22,14.97 23.67,14.97 v23.92,14.7 | v32.33,14.08 32.05,13.8 32.05,12.47 32.73,11.79 34.17,11.77 34.63,11.31 34.63,10.77 34.19,10.43 U7.MODE
MISO  (via drill 0.3)
  Top 0.254: v17.65,16.25 17.5,16.4 17.5,19.05 17.75,19.3 17.75,21.5 18.3,22.05 19.05,22.05 20.98,23.98 JP9.3 JP8.4
  Bottom 0.254: U3.11 17.5,16.4 v17.65,16.25
MOSI  (via drill 0.3)
  Top 0.254: v18.55,14.4 18.35,14.6 18.35,19 19.15,19.3 19.25,19.4 19.25,21.55 19.95,22.25 22.45,22.25 23.52,23.32 JP8.3 23.52,24.25 JP9.4
  Bottom 0.254: v18.55,14.4 16.65,14.4 15.04,15.91 U3.10
N$1
  Bottom 0.25: 17.24,17.77 17.24,18.34 17.11,18.47 17.11,20.26 Y1.1 18.19,21.79 | C4.1 15.9,21.75 16.13,21.73
  Bottom 0.254: C4.1 Y1.1
  Bottom 0.3: 18.19,21.79 18.46,21.72
N$2
  Bottom 0.25: 17.73,17.77 17.73,18.06 18.1,18.41 19.48,18.42 20.42,19.36 21.59,19.36 Y1.3 22.43,19.34
  Bottom 0.254: 22.43,19.34 24.09,19.34 C2.1
N$3  (via drill 0.3)
  Top 0.254: v5.4,14.1 3.95,14.1 JP4.D-
  Bottom 0.254: R7.2 5.51,14.21 v5.4,14.1
N$4  (via drill 0.3)
  Top 0.254: v15.2,14.1 15.9,13.1 15.9,11.7 14.55,10.7 v14.55,9.05
  Bottom 0.254: U3.6 14.75,13.95 v15.2,14.1 | v14.55,9.05 14.27,8.72 C5.2
N$5
  Bottom 0.254: R9.1 1.62,17.62 2.8,18.95 3.7,19.85 3.7,21.7 3.25,22.15 U6.1
N$6
  Top 0.254: SJ1.1 42.65,8.8 42.95,9.1 42.95,10.9 43.4,11.35 43.4,12.34 U9.-
N$8  (via drill 0.3)
  Top 0.254: v5.4,13 5,13.5 JP4.D+
  Bottom 0.254: R5.2 5.4,12.87 v5.4,13
N$9  (via drill 0.3)
  Top 0.254: CHRG.A 3.2,7.4 v3.2,6
  Bottom 0.254: v3.2,6 3.92,6.52 R3.2
N$10
  Bottom 0.254: U7.AOUT2 33.69,5.88 33.85,5.82 36.72,5.82 37.23,6.3 37.22,8.08 37.75,8.61 37.75,9.45 39.7,11.4 39.7,15.65 39.25,16.1 39.25,16.95 37.9,18.4 37.4,18.9 37.4,20.5 38.65,21.75 JP2.1
N$12
  Bottom 0.406: Q1.1 29.17,14.52 D2.2 29.17,16.45 R12.2
N$13
  Bottom 0.254: C3.2 33.52,14.69
  Bottom 0.406: 33.52,14.69 33.38,14.83 R10.1
N$14
  Top 0.254: SJ2.1 44,6.25 44.65,6.9 44.65,9.55 46.72,11.62 U9.+
N$21  (via drill 0.4)
  Top 0.406: v10.1,0.75 9.24,0.74 U$3.2
  Bottom 0.406: v10.1,0.75 10.7,1.35 12.25,1.35 13.65,2.45 13.65,4 14.9,5.2 18.1,5.2 D1.1
N$35
  Bottom 0.254: BLE.C 31.99,21.15 R13.2
N$38  (via drill 0.3)
  Top 0.254: PWR.A 2.66,8.1 v2.8,8.25
  Bottom 0.254: v2.8,8.25 1.89,8.25 R11.1
PROG
  Bottom 0.3: U4.5 25.68,8.45 24.95,8.5 24.52,8.88 24.52,9.94 R1.2
RAW  (via drill 0.3, 0.4)
  Top 0.254: v14.22,0.68 14.45,0.91 14.45,5 13.85,5.6 v13.65,5.55
  Top 0.406: 3.42,20.57 4.61,22.21 U1.3 6.09,22.24 K2.2 K3.2 | 3.42,20.57 3.4,20.55 1.35,20.55 U1.5 | v3.3,17.8 3.3,20.2 3.42,20.57 | JP6.2 25.96,2.25 JP10.2 25.93,2.67 25.75,2.85 25.76,4.14 v25.75,4.25 26.35,4.9 v26.35,6.15 | JP4.VBUS 5,14.85 5,14.95 v5.15,15.05 | v10.3,4.45 10.3,1.8 11.55,0.65 11.95,0.65 11.98,0.68 | U$3.1 12.04,0.71 11.98,0.68 | v14.22,0.68 v14.21,0.68 11.98,0.68
  Bottom 0.254: 13.92,14.43 13.75,14.4 13.6,14.4 13.5,14.3 13.5,12.15 | 14.38,11.95 U3.2 13.58,11.97 13.5,12.15 | R3.1 4.66,8.61 4.1,9.2 | C7.1 21.84,8.06 22.78,7.35 24.69,7.36 25.31,6.49 U4.4 25.39,6.4 | C10.1 27.82,15.87 28.47,16.52 | 15.12,4.6 15.15,4.63 | v13.65,5.55 14.25,6.15 15.35,6.15 16.17,6.97 C6.2 15.2,8.01 15.2,9.3 14.8,9.7 14.8,10.65 14.45,11 13.75,11 13.5,11.25 13.5,12.15
  Bottom 0.3: 25.84,17.55 25.9,17.32 U5.3
  Bottom 0.4: 30.47,11.84 30.07,12.21 Q1.3 30.26,12.83 29.94,13.15 28.61,13.15 28.22,13.54 28.22,16.27 28.47,16.52 28.5,16.55 28.47,18.55 | U5.1 27.69,18.6 27.32,18.96 | 27.32,18.96 26.24,18.96 25.83,18.58 U5.3 | 27.32,18.96 28.13,18.96
  Bottom 0.406: 28.47,18.55 28.23,18.89 28.13,18.96 | v3.3,17.8 2.75,17.25 2.75,15.05 | R11.2 1.3,6.45 0.55,7.2 0.55,8.8 1,9.2 2.8,9.2 | 2.8,9.2 4.1,9.2 8.85,4.45 v10.3,4.45 | 2.8,9.2 2.8,12.5 3.1,12.8 3.1,14.15 2.75,14.5 2.75,15.05 | v14.22,0.68 14.36,0.87 14.35,2 14.35,3.88 15.12,4.6 25.25,4.6 25.5,4.35 v25.75,4.25 27.35,4.25 27.8,4.6 28.35,4.6 29.45,5.7 29.81,5.71 30.02,5.7 30.5,6.18 30.5,11.84 30.47,11.84 | JP10.2 25.75,2.46 | v5.15,15.05 2.75,15.05 | 25.39,6.4 26.14,6.4 v26.35,6.15
RESET  (via drill 0.3)
  Top 0.254: v15.4,18.4 15.85,18.85 15.85,22.95 16.8,23.9 18.44,23.9 | 18.44,23.9 JP8.5 | 18.44,23.9 JP9.2
  Bottom 0.254: 15.76,17.77 15.76,17.89 v15.4,18.4 14.75,19.05 14.75,19.6 R2.1 | 18.44,23.94 JP9.2
RGB_LED  (via drill 0.3)
  Top 0.254: v6.45,20.5 U1.2
  Bottom 0.254: v6.45,20.5 6.45,21.1 7.15,21.9 13.71,21.9 13.93,21.68 13.93,18.82 15.27,17.54 U3.12
RXI  (via drill 0.3)
  Top 0.254: U$2.UART_TX 15.55,7.53 15.5,8.25 15.5,10.25 15.85,10.6 19.35,10.6 20.7,11.95 20.7,14.65 19.43,15.92 v19.43,16.43
  Bottom 0.254: U3.20 19.25,17.22 19.25,16.61 v19.43,16.43
SCK  (via drill 0.3)
  Top 0.254: v19.25,13.75 19.3,13.8 19.3,14.6 18.8,15.1 18.8,17.4 20.55,19.15 25.05,19.15 25.25,19.35 25.25,21.4 26.06,22.21 JP9.5 JP8.2
  Bottom 0.254: U3.9 14.41,15.4 14.85,15.4 16.5,13.75 v19.25,13.75
SENSOR  (via drill 0.3)
  Top 0.254: v16.7,11.8 16.85,11.95 16.85,13.85 v13.7,17.05
  Bottom 0.254: U3.41 16.75,11.25 16.7,11.3 v16.7,11.8 | v13.7,17.05 13.5,17.25 13.5,21.15 13.25,21.4 7.3,21.4 7.05,21.15 7.05,19.75 6.46,19.16 R4.2 4.98,20.36 U6.3
SENSOR_LED  (via drill 0.3)
  Top 0.254: v17.55,11.75 17.55,12.25 17.4,12.4 17.4,14.1 15.95,15.6 15.3,16.3 13.75,17.85 13.75,21.65 13.45,21.95 7.8,21.95 7.2,21.35 5.05,21.35 v4.85,21.3
  Bottom 0.254: U3.40 17.2,10.64 17.2,11.2 v17.55,11.75 | v4.85,21.3 4.94,21.46 U6.2
SERVO1  (via drill 0.3)
  Top 0.254: v18.4,11.6 18.4,11.75 18,12.35 18,13.85 17.9,13.95 17.9,14.35 16.85,15.35 15.8,16.45 14.25,18 14.25,22 13.85,22.4 9.35,22.45 K2.1
  Bottom 0.254: U3.39 17.75,10.62 17.75,11.15 18.2,11.4 18.25,11.4 v18.4,11.6
SERVO2  (via drill 0.3)
  Top 0.254: v17.75,15.35 17.5,15.35 14.75,18.15 14.75,22.45 | 14.75,22.45 13.85,23.4 12.05,23.4 K3.1 | JP8.6 JP9.1 14.75,24.35 14.75,22.45
  Bottom 0.254: 18.22,17.77 18.25,16.94 18.25,15.9 v17.75,15.35
STAT  (via drill 0.3)
  Top 0.254: v12.9,5.35 4.3,5.35 4.05,5.6 4.05,6.7 CHRG.C
  Bottom 0.254: U4.1 28.71,8.39 29.2,7.9 29.2,6.25 28.65,5.7 28.35,5.7 27.8,5.1 27.5,5.1 27.25,4.85 25.75,4.85 25.5,5.1 20.95,5.1 20.6,5.45 20.6,7.1 20.2,7.5 18.6,7.5 18.3,7.2 18.3,6.45 17.55,5.7 14.65,5.7 13.7,4.75 13.15,4.75 12.9,5 v12.9,5.35
  Bottom 0.3: 28.35,8.4 U4.1
TXO  (via drill 0.3)
  Top 0.254: U$2.UART_RX 17.05,7.53 17.05,8.95 18.2,10.1 19.55,10.1 21.16,11.71 21.15,11.72 v21.15,17.25
  Bottom 0.254: v21.15,17.25 21.15,18.05 20.85,18.35 20.05,18.35 19.7,18 19.7,17.77
VBAT_ALWAYS_ON  (via drill 0.4)
  Top 0.254: 38.65,13.01 JP3.2
  Top 0.4: 36.56,9.45 37.85,10.66 38.65,11.43 38.65,13.01
  Top 0.406: 36.56,9.45 36.55,9.44 36.55,7.85 35.54,6.84 34.84,6.11 30.19,6.1 29.9,6.14 27.63,6.14 v27.34,5.8
  Bottom 0.25: U4.3 28.35,6.5
  Bottom 0.254: C8.1 23.3,6.45 23.3,5.6
  Bottom 0.406: 28,6.51 U4.3 27.5,6 v27.34,5.8 v27.34,5.79 27,5.35 26.1,5.35 25.8,5.6 23.3,5.6 22.7,5.6 D1.2
VM
  Bottom 0.254: 34.71,7.24 U7.VM
  Bottom 0.4: 34.71,7.24 35.27,7.26 35.73,7.26 35.96,7.48 | 36.65,8.14 36.65,8.68 37.17,9.26 37.17,9.92 37.7,10.45 37.69,11.03
  Bottom 0.406: 35.96,7.48 35.99,7.48 36.65,8.14 | 37.69,11.03 37.69,11.91 37.35,12.25 37.35,16.75 37.03,17.07 35.3,17.07 | Q1.2 31.47,14.64 D2.1 31.98,16.38 31.98,16.99 | 31.98,16.99 C9.2 | 31.98,16.99 32.06,17.07 35.3,17.07 | R10.2 35.3,16.27 35.3,17.07
(copper drawn outside any net)
  shapes: Bottom area x5216

### Text on the board
Dimension: CUT OUT
tPlace: - | - | + | + | * | A | s | s | 3 | RST | 14 | 16 | 15 | VCC | B | A | - | * | + | OFF-ON | A0 | 2 | B | 13 | RAW | GND | * | A1
bPlace: - | - | + | + | s | A | s | 3 | RST | 14 | 16 | 15 | VCC | * | B | A | - | * | + | B | * | A1 | A0 | 13 | 2 | GND | RAW
bNames: U7
tValues: Marco D'Alia